# Altium schematic sheet 04-1 MCU.SchDoc
size 420 x 297 mm; SheetNumber: 5; SheetTotal: 12
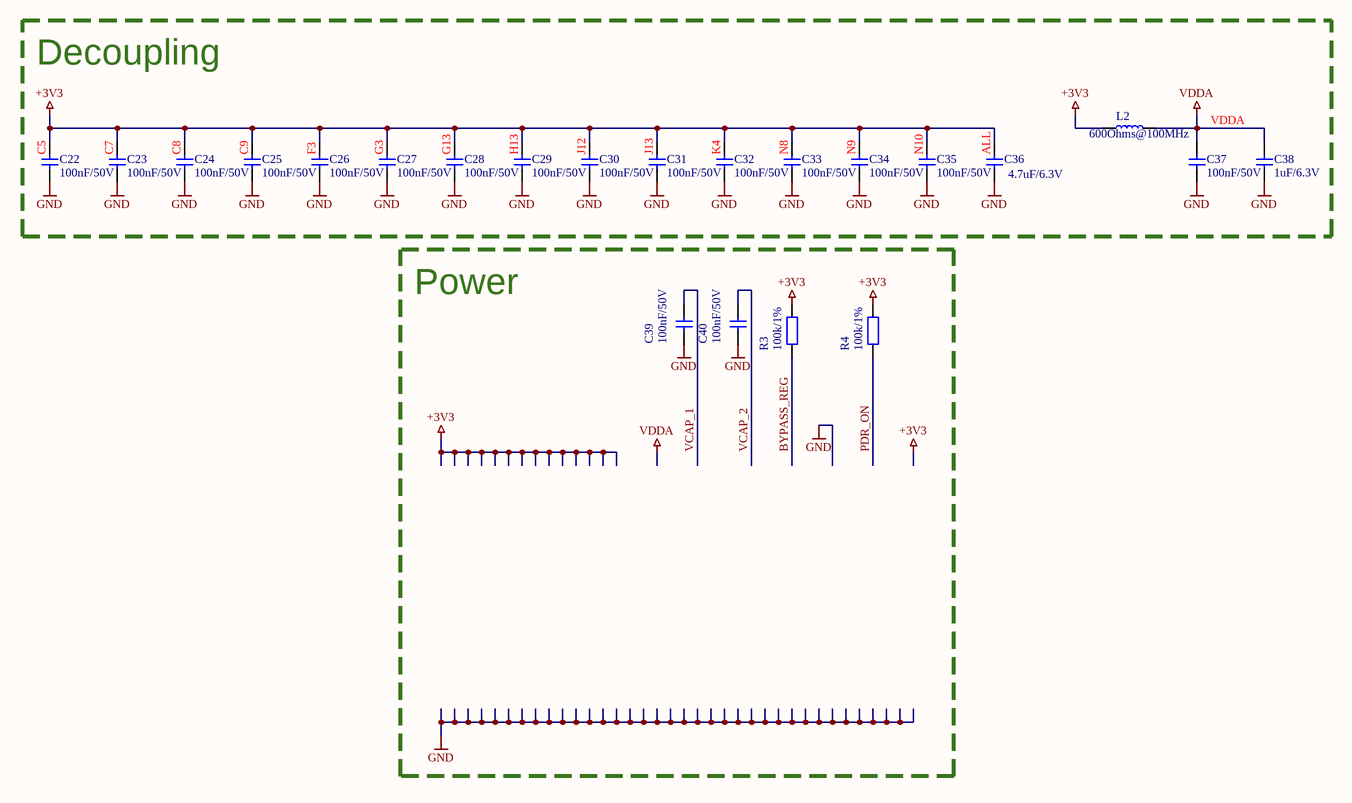
[diagram p0: 04-1 MCU.SchDoc]

## Parts
C22  100nF/50V  [CAPC1005X06M-0402]
C23  100nF/50V  [CAPC1005X06M-0402]
C24  100nF/50V  [CAPC1005X06M-0402]
C25  100nF/50V  [CAPC1005X06M-0402]
C26  100nF/50V  [CAPC1005X06M-0402]
C27  100nF/50V  [CAPC1005X06M-0402]
C28  100nF/50V  [CAPC1005X06M-0402]
C29  100nF/50V  [CAPC1005X06M-0402]
C30  100nF/50V  [CAPC1005X06M-0402]
C31  100nF/50V  [CAPC1005X06M-0402]
C32  100nF/50V  [CAPC1005X06M-0402]
C33  100nF/50V  [CAPC1005X06M-0402]
C34  100nF/50V  [CAPC1005X06M-0402]
C35  100nF/50V  [CAPC1005X06M-0402]
C36  4.7uF/6.3V  [CAPC1005X06M-0402]
C37  100nF/50V  [CAPC1005X06M-0402]
C38  1uF/6.3V  [CAPC1005X06M-0402]
C39  100nF/50V  [CAPC1005X06M-0402]
C40  100nF/50V  [CAPC1005X06M-0402]
L2  600Ohms@100MHz  [INDC1005X06M-0402]
R3  100k/1%  [RESC1005X04M-0402]
R4  100k/1%  [RESC1005X04M-0402]

## Blocks framed on the sheet
Decoupling: C22-C38 L2
Power: C39 C40 R3 R4

## Nets
+3V3: C22.2 C23.2 C24.2 C25.2 C26.2 C27.2 C28.2 C29.2 C30.2 C31.2 C32.2 C33.2 C34.2 C35.2 C36.2 L2.1 R3.1 R4.1
GND: C22.1 C23.1 C24.1 C25.1 C26.1 C27.1 C28.1 C29.1 C30.1 C31.1 C32.1 C33.1 C34.1 C35.1 C36.1 C37.1 C38.1 C39.1 C40.1
VDDA: C37.2 C38.2 L2.2
BYPASS_REG: R3.2
PDR_ON: R4.2
VCAP_1: C39.2
VCAP_2: C40.2

## Notes on the sheet
- VDDA
- (near C22) C5
- (near C23) C7
- (near C24) C8
- (near C25) C9
- (near C26) F3
- (near C27) G3
- (near C28) G13
- (near C29) H13
- (near C30) J12
- (near C31) J13
- (near C32) K4
- (near C33) N8
- (near C34) N9
- (near C35) N10
- (near C36) ALL
- Title
- Project
- Size
- Date
- Revision
- A3
- Designed By

## Library data of the parts
C22-C35 C37 C39 C40 = GRM155R71H104KE14D: 0.1 µF ±10% 50V Ceramic Capacitor X7R 0402 (1005 Metric); ComponentLink1Description: Datasheet; ComponentLink1URL: https://search.murata.co.jp/Ceramy/image/img/A01X/G101/ENG/GRM155R60J475ME47-01.pdf; MPN: GRM155R71H104KE14D
C36 = GRM155R60J475ME47D: 4.7 µF ±20% 6.3V Ceramic Capacitor X5R 0402 (1005 Metric); ComponentLink1Description: Datasheet; ComponentLink1URL: https://search.murata.co.jp/Ceramy/image/img/A01X/G101/ENG/GRM155R60J475ME47-01.pdf; MPN: GRM155R60J475ME47D
C38 = GRM155R70J105KA12J: 1 µF ±10% 6.3V Ceramic Capacitor X7R 0402 (1005 Metric); ComponentLink1Description: Datasheet; ComponentLink1URL: https://search.murata.co.jp/Ceramy/image/img/A01X/G101/ENG/GRM155R60J475ME47-01.pdf; MPN: GRM155R70J105KA12J
L2 = BLM15AG601SN1D: 600 Ohms @ 100 MHz 1 Ferrite Bead 0402 (1005 Metric) 300mA 520mOhm; ComponentLink1Description: Datasheet; ComponentLink1URL: https://www.murata.com/en-us/products/productdata/8796740059166/ENFA0018.pdf; MPN: BLM15AG601SN1D
R3 R4 = RC0402FR-07100KL: 100 kOhms ±1% 0.063W, 1/16W Chip Resistor 0402 (1005 Metric) Moisture Resistant Thick Film; ComponentLink1Description: Datasheet; ComponentLink1URL: https://www.yageo.com/upload/media/product/productsearch/datasheet/rchip/PYu-RC_Group_51_RoHS_L_12.pdf; MPN: RC0402FR-07100KL